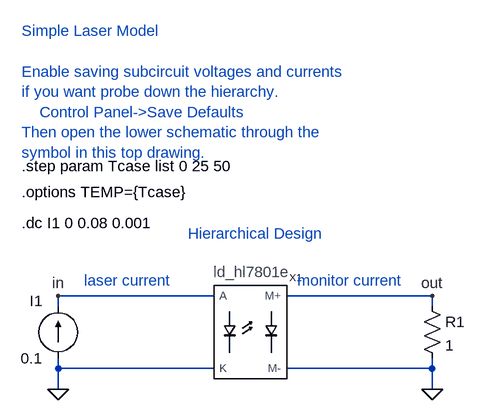
[diagram p0: schematic ld_hl7801e_test.asc]
ld_hl7801e_test.asc, the LTspice schematic file:
Version 4
SHEET 1 1556 680
WIRE 0 128 0 112
WIRE 0 224 0 208
WIRE 0 256 0 224
WIRE 240 112 0 112
WIRE 240 224 0 224
WIRE 576 112 352 112
WIRE 576 128 576 112
WIRE 576 224 352 224
WIRE 576 224 576 208
WIRE 576 256 576 224
FLAG 576 256 0
FLAG 0 256 0
FLAG 0 112 in
FLAG 576 112 out
SYMBOL current 0 208 R180
WINDOW 0 24 88 Left 0
WINDOW 3 24 0 Left 0
SYMATTR InstName I1
SYMATTR Value 0.1
SYMBOL res 560 112 R0
SYMATTR InstName R1
SYMATTR Value 1
SYMBOL ld_hl7801e 288 160 R0
SYMATTR InstName X1
TEXT -56 0 Left 0 !.dc I1 0 0.08 0.001
TEXT -56 -88 Left 0 !.step param Tcase list 0 25 50
TEXT -56 -48 Left 0 !.options TEMP={Tcase}
TEXT 200 16 Left 0 ;Hierarchical Design
TEXT -56 -296 Left 0 ;Simple Laser Model\n \nEnable saving subcircuit voltages and currents \nif you want probe down the hierarchy.\n    Control Panel->Save Defaults\nThen open the lower schematic through the \nsymbol in this top drawing.
TEXT 368 88 Left 0 ;monitor current
TEXT 40 88 Left 0 ;laser current

The netlist it stands for:
* ld_hl7801e_test.asc
I1 0 in 0.1
R1 out 0 1
XX1 in 0 out 0 ld_hl7801e  ; pins A K M+ M-
.dc I1 0 0.08 0.001
.step param Tcase list 0 25 50
.options TEMP={Tcase}
* Hierarchical Design
* Simple Laser Model
* Enable saving subcircuit voltages and currents
* if you want probe down the hierarchy.
*     Control Panel->Save Defaults
* Then open the lower schematic through the
* symbol in this top drawing.
* monitor current
* laser current
.backanno
.end